# EAGLE design hdsp-clock (EAGLE 9.1.0)
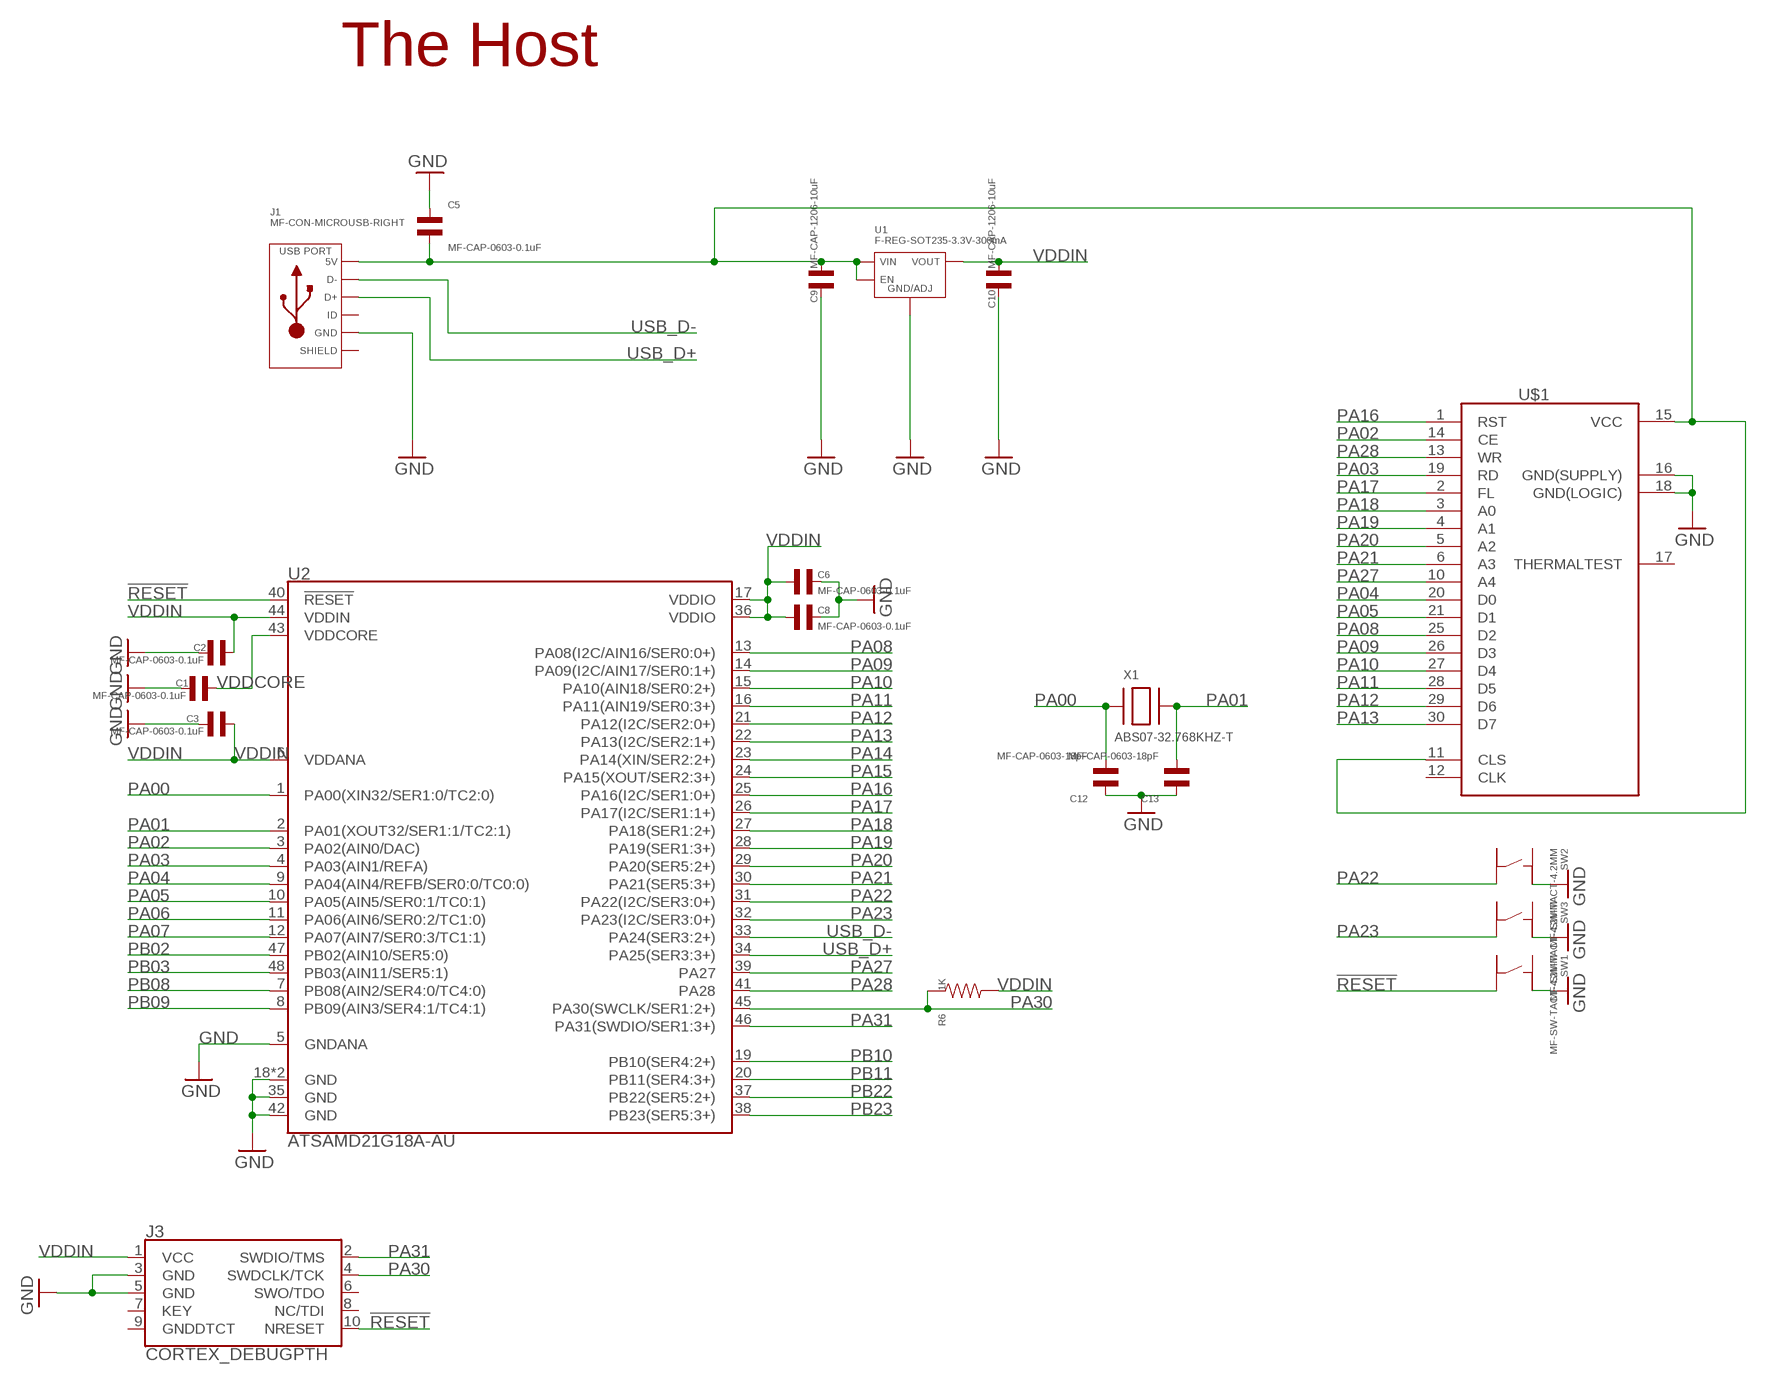
[diagram p0: schematic, sheet 1]

## Parts
C1  MF-CAP-0603-0.1uF  CAPACITOR_NP_0603  [C0603]
C2  MF-CAP-0603-0.1uF  CAPACITOR_NP_0603  [C0603]
C3  MF-CAP-0603-0.1uF  CAPACITOR_NP_0603  [C0603]
C5  MF-CAP-0603-0.1uF  CAPACITOR_NP_0603  [C0603]
C6  MF-CAP-0603-0.1uF  CAPACITOR_NP_0603  [C0603]
C8  MF-CAP-0603-0.1uF  CAPACITOR_NP_0603  [C0603]
C9  MF-CAP-1206-10uF  CAPACITOR_NP_1206  [C1206]
C10  MF-CAP-1206-10uF  CAPACITOR_NP_1206  [C1206]
C12  MF-CAP-0603-18pF  CAPACITOR_NP_0603  [C0603]
C13  MF-CAP-0603-18pF  CAPACITOR_NP_0603  [C0603]
J1  MF-CON-MICROUSB-RIGHT  USB_MICRO_RIGHT  [MICROUSB-RIGHT]
J3  CORTEX_DEBUGPTH  [2X5-PTH-1.27MM]
R6  1K  RESISTOR_0603  [R0603]
SW1  MF-SW-TACT-4.2MM  TACT_4.2MM  [TACT4.2MM]
SW2  MF-SW-TACT-4.2MM  TACT_4.2MM  [TACT4.2MM]
SW3  MF-SW-TACT-4.2MM  TACT_4.2MM  [TACT4.2MM]
U1  F-REG-SOT235-3.3V-300mA  TLV70233PDBVR  [SOT-23-5]
U2  ATSAMD21G18A-AU  ATSAMD21G-M  [QFN-48]
U$1  HDSP-253X  [HDSP-253X]
X1  ABS07-32.768KHZ-T  XTAL-3.2X1.5  [XTAL3215]

## Nets
!RESET: J3.10(NRESET) SW1.P$4 U2.40(!RESET!)
GND [Power]: C1.P$2 C2.P$1 C3.P$1 C5.P$1 C6.P$1 C8.P$1 C9.P$2 C10.P$2 C12.P$1 C13.P$1 J1.5(GND) J3.3(GND) J3.5(GND) SW1.P$2 SW2.P$2 SW3.P$2 U1.P$2(GND/ADJ) U1.P$4(GND/ADJ) U2.5(GNDANA) U2.18(GND) U2.35(GND) U2.42(GND) U2.EP(GND) U$1.16(GND(SUPPLY)) U$1.18(GND(LOGIC))
N$25: C5.P$2 C9.P$1 J1.1(5V) U1.P$1(VIN) U1.P$3(EN) U$1.11(CLS) U$1.15(VCC)
PA00: C12.P$2 U2.1(PA00(XIN32/SER1:0/TC2:0)) X1.P$1
PA01: C13.P$2 U2.2(PA01(XOUT32/SER1:1/TC2:1)) X1.P$2
PA02: U2.3(PA02(AIN0/DAC)) U$1.14(CE)
PA03: U2.4(PA03(AIN1/REFA)) U$1.19(RD)
PA04: U2.9(PA04(AIN4/REFB/SER0:0/TC0:0)) U$1.20(D0)
PA05: U2.10(PA05(AIN5/SER0:1/TC0:1)) U$1.21(D1)
PA06: U2.11(PA06(AIN6/SER0:2/TC1:0))
PA07: U2.12(PA07(AIN7/SER0:3/TC1:1))
PA08: U2.13(PA08(I2C/AIN16/SER0:0+)) U$1.25(D2)
PA09: U2.14(PA09(I2C/AIN17/SER0:1+)) U$1.26(D3)
PA10: U2.15(PA10(AIN18/SER0:2+)) U$1.27(D4)
PA11: U2.16(PA11(AIN19/SER0:3+)) U$1.28(D5)
PA12: U2.21(PA12(I2C/SER2:0+)) U$1.29(D6)
PA13: U2.22(PA13(I2C/SER2:1+)) U$1.30(D7)
PA14: U2.23(PA14(XIN/SER2:2+))
PA15: U2.24(PA15(XOUT/SER2:3+))
PA16: U2.25(PA16(I2C/SER1:0+)) U$1.1(RST)
PA17: U2.26(PA17(I2C/SER1:1+)) U$1.2(FL)
PA18: U2.27(PA18(SER1:2+)) U$1.3(A0)
PA19: U2.28(PA19(SER1:3+)) U$1.4(A1)
PA20: U2.29(PA20(SER5:2+)) U$1.5(A2)
PA21: U2.30(PA21(SER5:3+)) U$1.6(A3)
PA22: SW2.P$4 U2.31(PA22(I2C/SER3:0+))
PA23: SW3.P$4 U2.32(PA23(I2C/SER3:0+))
PA27: U2.39(PA27) U$1.10(A4)
PA28: U2.41(PA28) U$1.13(WR)
PA30: J3.4(SWDCLK/TCK) R6.P$1 U2.45(PA30(SWCLK/SER1:2+))
PA31: J3.2(SWDIO/TMS) U2.46(PA31(SWDIO/SER1:3+))
PB02: U2.47(PB02(AIN10/SER5:0))
PB03: U2.48(PB03(AIN11/SER5:1))
PB08: U2.7(PB08(AIN2/SER4:0/TC4:0))
PB09: U2.8(PB09(AIN3/SER4:1/TC4:1))
PB10: U2.19(PB10(SER4:2+))
PB11: U2.20(PB11(SER4:3+))
PB22: U2.37(PB22(SER5:2+))
PB23: U2.38(PB23(SER5:3+))
USB_D+: J1.3(D+) U2.34(PA25(SER3:3+))
USB_D-: J1.2(D-) U2.33(PA24(SER3:2+))
VDDCORE: C1.P$1 U2.43(VDDCORE)
VDDIN: C2.P$2 C3.P$2 C6.P$2 C8.P$2 C10.P$1 J3.1(VCC) R6.P$2 U1.P$5(VOUT) U2.6(VDDANA) U2.17(VDDIO) U2.36(VDDIO) U2.44(VDDIN)
Unconnected: J1.4(ID) J3.6(SWO/TDO) J3.7(KEY) J3.8(NC/TDI) J3.9(GNDDTCT) SW1.P$1 SW1.P$3 SW2.P$1 SW2.P$3 SW3.P$1 SW3.P$3 U$1.12(CLK) U$1.17(THERMALTEST)

## Notes on the sheet
- The Host

## Power pins joined to a net without a drawn wire
SLD: J1.S1(SLD) J1.S2(SLD) J1.S3(SLD) J1.S4(SLD) J1.S5(SLD) J1.S6(SLD)

## Library data of the parts
C1-C3 C5 C6 C8-C10 C12 C13 = MF_Passives:CAPACITOR_NP: Library: MF_Passives Description: Device for Non-Polarized Capacitors. Manufacture part number (MPN) can be added via Attributes. Check https://factory.macrofab.com/parts for the house parts list.; POPULATE: 1
J1 = MF_Connectors:USB: Library: MF_Connectors Description: 5 Pin USB Connectors. SLD is the shield connection. Usually tied to ground through a small ferrite bead.; HOUSEPART: YES; MPN: MF-CON-MICROUSB-RIGHT; POPULATE: 1; URL: https://factory.macrofab.com/part/MF-CON-MICROUSB-RIGHT
J3 = SparkFun-Connectors:CORTEX_DEBUG: Cortex Debug Connector Datasheet <http://infocenter.arm.com/help/topic/com.arm.doc.faqs/attached/13634/cortex_debug_connectors.pdf>
R6 = MF_Passives:RESISTOR: Library: MF_Passives Description: Device for Resistors. Manufacture part number (MPN), Voltage, Tolerance, and Wattage Rating can be added via Attributes. Check https://factory.macrofab.com/parts for the house parts list.; POPULATE: 1
SW1-SW3 = MF_Switches:TACT: Library: MF_Switches Description: Device for Tact Switches. Manufacture part number (MFG#) can be added via Attributes.; HOUSEPART: YES; MPN: MF-SW-TACT-4.2MM; POPULATE: 1; URL: https://factory.macrofab.com/part/MF-SW-TACT-4.2MM
U1 = MF_IC_Power:TLV702: Manufacturer Part #: TLV702 Manufacturer: Texas Instruments Description: LDO Voltage Regulators; HOUSEPART: YES; MPN: F-REG-SOT235-3.3V-300mA; POPULATE: 1; URL: https://factory.macrofab.com/part/MF-REG-SOT235-3.3V-300mA
U2 = SparkFun-DigitalIC:ATSAMD21G: Atmel SAMD21G SMART ARM-Based Microcontroller The Atmel ® | SMART ™ SAM D21 is a series of low-power microcontrollers using the 32-bit ARM ® Cortex ® -M0+ processor, and ranging from 32- to 64-pins with up to 256KB Flash and 32KB of SRAM. The SAM D21 devices operate at a maximum frequency of 48MHz and reach 2.46 CoreMark/MHz. They are designed for simple and intuitive migration with identical peripheral modules, hex compatible code, identical linear address map and pin compatible migration paths between all devices in the product series. All devices include intelligent and flexible peripherals, Atmel Event System for inter-peripheral signaling, and support for capacitive touch button, slider and wheel user interfaces.; PROD_ID: IC-13064
U$1 = sonik:HDSP-253X
X1 = adafruit:XTAL: Low cost SMT crystals, no capacitors included http://www.ladyada.net/library/eagle

## Net classes
1 Power: width 0.203 mm

## Board
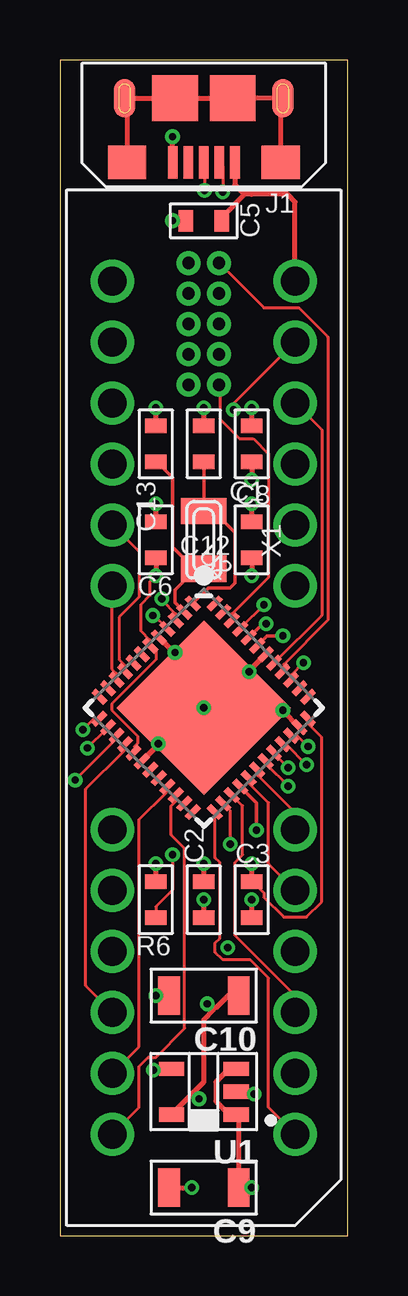
[diagram p1: board, top side]
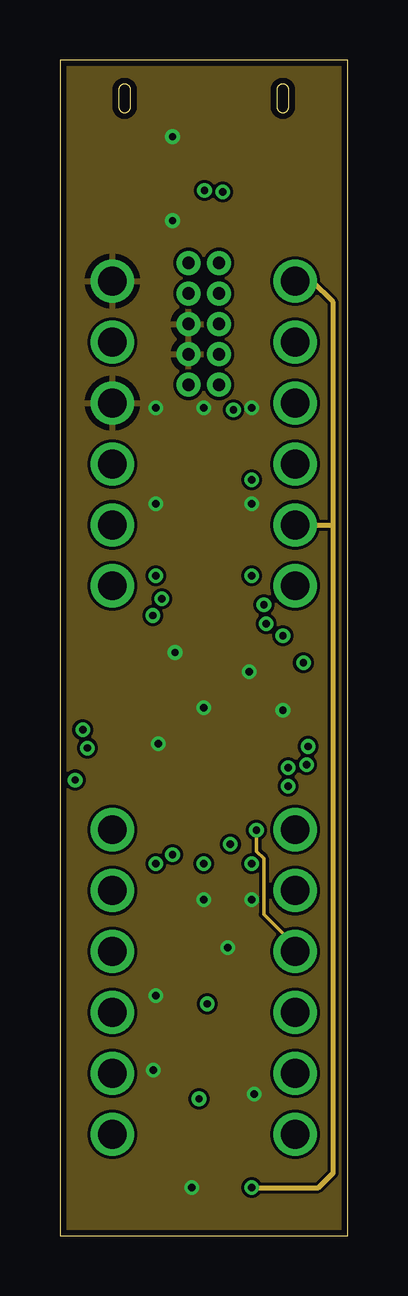
[diagram p2: board, inner layer Route2]
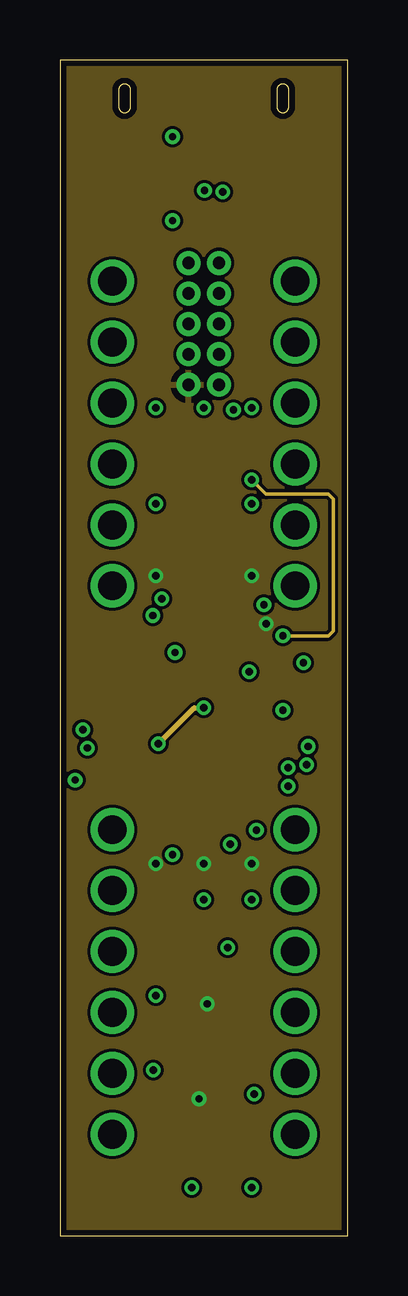
[diagram p3: board, inner layer Route15]
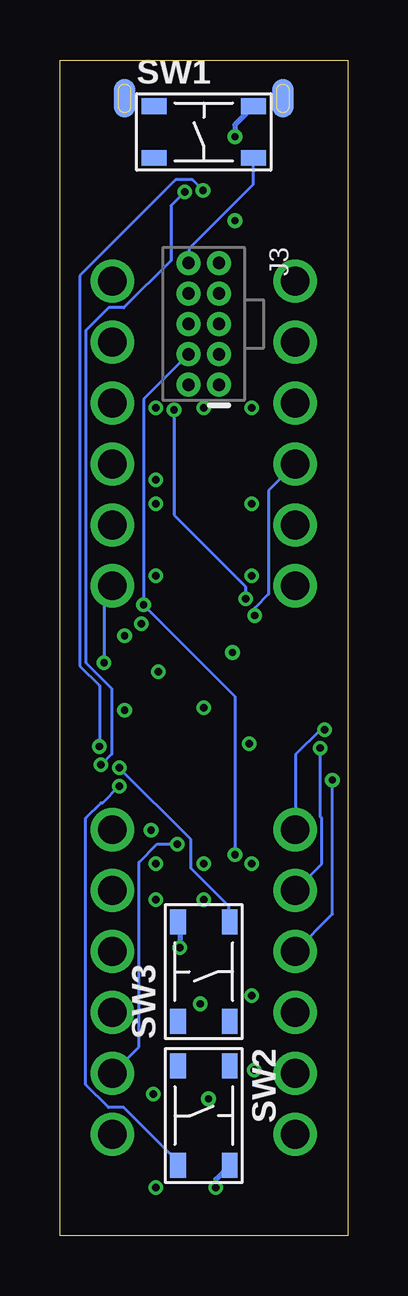
[diagram p4: board, bottom side, seen from below]

Size 12 x 49 mm. Coordinates in mm from the lower left corner, seen from the top.
Outline: 0,0 12,0 12,49 0,49 0,0
Copper layers (1*2*15*16): Top 0.035mm / dielectric 0.23mm / Route2 0.035mm / dielectric 0.93mm / Route15 0.035mm / dielectric 0.23mm / Bottom 0.035mm
Design rules "MF_Standard_4_Layer": minimum track width 5mil, minimum drill 12mil, track to track 5mil, track to pad 5mil, pad to pad 5mil, via to via 5mil, smd to smd 0mil, copper to edge 10mil, drill to drill 10mil, minimum pad ring 6mil, minimum via ring 6mil, stop-mask expansion 2mil, vias tented up to drill 25mil, thermal gap 10mil

### Footprints (pad centres in the part's own frame; a part is rotated, then mirrored left to right if it is on the bottom)
C0603 = smd 0.6 x 0.9: P$1 -0.75,0; P$2 0.75,0
C1206 = smd 0.9 x 1.6: P$1 -1.45,0; P$2 1.45,0
MICROUSB-RIGHT = smd 0.4 x 1.35: 1 -1.3,1.27; 2 -0.65,1.27; 3 0,1.27; 4 0.65,1.27; 5 1.3,1.27 | smd 0.9 x 1.6: S1 -3.3,-1.4; S2 3.3,-1.4 | smd 1.6 x 1.4: S3 -3.2,1.27; S4 3.2,1.27 | smd 1.9 x 1.9: S5 -1.2,-1.405; S6 1.2,-1.405 | smd 0.9 x 1.6 bottom: S7 -3.3,-1.4; S8 3.3,-1.4
2X5-PTH-1.27MM = drill 0.508 pad 1: 1 -2.54,-0.635; 2 -2.54,0.635; 3 -1.27,-0.635; 4 -1.27,0.635; 5 0,-0.635; 6 0,0.635; 7 1.27,-0.635; 8 1.27,0.635; 9 2.54,-0.635; 10 2.54,0.635
R0603 = smd 0.6 x 0.9: P$1 -0.75,0; P$2 0.75,0
TACT4.2MM = smd 1.05 x 0.65: P$1 -2.075,1.075; P$2 2.075,1.075; P$3 -2.075,-1.075; P$4 2.075,-1.075
SOT-23-5 = smd 1.05 x 0.6: P$1 -1.35,0.95; P$2 -1.35,0; P$3 -1.35,-0.95; P$4 1.35,-0.95; P$5 1.35,0.95
QFN-48 = smd 0.7 x 0.25: 1 -3.4,2.75; 2 -3.4,2.25; 3 -3.4,1.75; 4 -3.4,1.25; 5 -3.4,0.75; 6 -3.4,0.25; 7 -3.4,-0.25; 8 -3.4,-0.75; 9 -3.4,-1.25; 10 -3.4,-1.75; 11 -3.4,-2.25; 12 -3.4,-2.75; 25 3.4,-2.75; 26 3.4,-2.25; 27 3.4,-1.75; 28 3.4,-1.25; 29 3.4,-0.75; 30 3.4,-0.25; 31 3.4,0.25; 32 3.4,0.75; 33 3.4,1.25; 34 3.4,1.75; 35 3.4,2.25; 36 3.4,2.75 | smd 0.25 x 0.7: 13 -2.75,-3.4; 14 -2.25,-3.4; 15 -1.75,-3.4; 16 -1.25,-3.4; 17 -0.75,-3.4; 18 -0.25,-3.4; 19 0.25,-3.4; 20 0.75,-3.4; 21 1.25,-3.4; 22 1.75,-3.4; 23 2.25,-3.4; 24 2.75,-3.4; 37 2.75,3.4; 38 2.25,3.4; 39 1.75,3.4; 40 1.25,3.4; 41 0.75,3.4; 42 0.25,3.4; 43 -0.25,3.4; 44 -0.75,3.4; 45 -1.25,3.4; 46 -1.75,3.4; 47 -2.25,3.4; 48 -2.75,3.4 | smd 5.15 x 5.15: EP 0,0
HDSP-253X = drill 1.2: 1 -17.78,-3.81; 2 -15.24,-3.81; 3 -12.7,-3.81; 4 -10.16,-3.81; 5 -7.62,-3.81; 6 -5.08,-3.81; 10 5.08,-3.81; 11 7.62,-3.81; 12 10.16,-3.81; 13 12.7,-3.81; 14 15.24,-3.81; 15 17.78,-3.81; 16 17.78,3.81; 17 15.24,3.81; 18 12.7,3.81; 19 10.16,3.81; 20 7.62,3.81; 21 5.08,3.81; 25 -5.08,3.81; 26 -7.62,3.81; 27 -10.16,3.81; 28 -12.7,3.81; 29 -15.24,3.81; 30 -17.78,3.81
XTAL3215 = smd 1.1 x 1.9: P$1 1.2,0; P$2 -1.2,0

### Placement (x,y rotation side)
C1  8,33 90 top
C2  6,14 90 top
C3  8,14 90 top
C5  6,42.3 0 top
C6  4,29 270 top
C8  8,29 270 top
C9  6,2 180 top
C10  6,10 180 top
C12  6,33 270 top
C13  4,33 270 top
J1  6,46 180 top
J3  6,38 90 bottom
R6  4,14 90 top
SW1  6,46 0 bottom
SW2  6,5 270 bottom
SW3  6,11 90 bottom
U1  6,6 180 top
U2  6,22 315 top
U$1  6,22 90 top
X1  6,29 90 top

### Tracks (layer width: path | path; a pad name or v marks a point on that pad's centre or on a via)
!RESET
  Top 0.127: U2.40 9.34,23.56 9.34,23.81 11.18,25.65 11.18,37.47 9.97,38.67 8.51,38.67 6.67,40.51 J3.10
  Bottom 0.127: SW1.P$4 3.94,44.9 3.94,43.81 6.6,41.15 6.6,40.58 J3.10
GND  (via drill 0.3)
  Top 0.203: C3.P$1 v8,14 | C2.P$1 v6,14 | C10.P$2 v4,10 | U1.P$2 7.7,6 7.8,5.9 v8.1,5.9 | U1.P$4 3.95,6.95 v3.9,6.9 | C9.P$2 v5.5,2 | C5.P$1 v4.7,42.3 | J1.5 v4.7,45.8 | C13.P$1 v4,34.5 | C12.P$1 v6,34.5 | C1.P$2 v8,34.5 | U2.42 7.9,23.55 v7.9,23.5 | U2.5 4.76,24.3 v4.8,24.3 | U2.18 4.1,20.45 v4.1,20.5 | U2.35 9.3,21.88 v9.3,21.9 | C6.P$1 v4,30.5 | C8.P$1 v8,30.5
  Route15 0.203: v4.1,20.5 5.6,22 U2.EP
  Bottom 0.203: SW3.P$2 7,13 v7,12 | SW2.P$2 5.5,2.35 v5.5,2 | SW1.P$2 4.7,46.3 v4.7,45.8
  other vias: 6,22
  pour Route2: 0,48.96 12,48.96 12,0 0,0
N$25  (via drill 0.3)
  Top 0.203: v8,2 C9.P$1 7.45,4.95 U1.P$1 7.05,5.05 6.5,5.6 6.5,6.4 7.05,6.95 U1.P$3 | U$1.15 9.81,43.09 9.5,43.4 8,43.4 7.7,43.4 | 7.7,43.4 6.75,42.45 C5.P$2 | J1.1 7.3,43.8 7.7,43.4
  Route2 0.203: 11.4,29.6 11.4,2.61 10.78,1.99 v8.01,1.99 v8,2 | 11.4,29.6 11.4,38.9 10.52,39.78 U$1.15 | U$1.11 11.38,29.62 11.4,29.6
PA00
  Top 0.152: C12.P$2 X1.P$1 6.4,30.2 7.3,29.3 7.3,27.2 7.1,27 6.19,27 U2.1
PA01
  Top 0.152: C13.P$2 4.05,32.25 4.7,31.6 4.7,28.7 5.6,27.8 X1.P$2 5.7,27.8 4.8,26.9 4.8,26.38 U2.2
PA02  (via drill 0.3)
  Top 0.127: v4.25,26.54 4.25,26.48 4.83,25.91 4.83,25.65 U2.3 | v7.24,34.42 7.24,34.67 9.78,37.21 U$1.14
  Bottom 0.127: v4.25,26.54 4.25,27.05 7.24,30.04 v7.24,34.42
PA03  (via drill 0.3)
  Top 0.127: v3.87,25.84 3.94,25.84 4.45,25.34 U2.4
  Bottom 0.127: v3.87,25.84 3.87,26.16 3.3,26.73 3.3,31.05 2.22,32.13 U$1.19
PA04
  Top 0.127: U2.9 2.67,23.56 2.67,23.81 2.48,24 2.48,25.78 3.3,26.61 3.3,28.51 2.22,29.59 U$1.20
PA05
  Top 0.127: U2.10 2.35,23.18 2.35,23.43 2.16,23.62 2.16,27.05 U$1.21
PA08  (via drill 0.3)
  Top 0.127: v0.95,21.08 1.4,21.53 1.65,21.53 U2.13
  Bottom 0.127: v0.95,21.08 1.14,21.08 2.16,20.07 2.16,16.95 U$1.25
PA09  (via drill 0.3)
  Top 0.127: v1.14,20.32 1.97,21.14 U2.14
  Bottom 0.127: v1.14,20.32 1.14,17.46 1.08,17.4 1.08,15.49 2.16,14.41 U$1.26
PA10  (via drill 0.3)
  Top 0.127: v0.64,18.99 2.35,20.7 2.35,20.83 U2.15
  Bottom 0.127: v0.64,18.99 0.64,13.4 2.16,11.87 U$1.27
PA11
  Top 0.127: U2.16 2.67,20.45 2.67,20.19 1.08,18.61 1.08,10.41 2.16,9.34 U$1.28
PA12
  Top 0.127: U2.21 4.45,18.67 4.45,18.48 3.3,17.34 3.3,7.87 2.22,6.79 U$1.29
PA13
  Top 0.127: U2.22 4.83,18.1 4.64,17.91 4.64,16.7 5.21,16.13 5.21,8.64 4,7.43 3.68,7.43 3.3,7.05 3.3,5.33 2.22,4.25 U$1.30
PA16
  Top 0.127: U2.25 6.48,17.59 6.48,15.75 6.67,15.56 6.67,12.38 6.48,12.19 6.48,11.81 6.79,11.49 7.94,11.49 8.7,10.73 8.7,5.33 9.78,4.25 U$1.1
PA17  (via drill 0.3)
  Top 0.127: v7.11,16.32 7.11,17.7 U2.26
  Bottom 0.127: v7.11,16.32 7.94,16.32 8.7,15.56 8.7,7.87 9.78,6.79 U$1.2
PA18
  Top 0.127: U2.27 7.62,17.91 7.62,15.87 7.3,15.56 7.3,12.51 9.78,10.03 9.78,9.34 U$1.3
PA19  (via drill 0.3)
  Top 0.152: U2.28 8.2,18.03 v8.2,16.9
  Route2 0.152: v8.2,16.9 8.2,16.02 8.51,15.71 8.51,13.39 9.81,12.09 U$1.4
PA20
  Top 0.127: U2.29 7.87,19.05 7.87,18.86 8.7,18.03 8.7,15.49 9.78,14.41 U$1.5
PA21
  Top 0.127: U2.30 8.26,19.37 8.26,19.18 9.78,17.65 9.78,16.95 U$1.6
PA22  (via drill 0.3)
  Top 0.127: v9.53,18.73 8.64,19.62 8.64,19.75 U2.31
  Bottom 0.127: v9.53,18.73 10.22,18.03 10.29,18.03 10.92,17.4 10.92,6.29 9.97,5.33 9.34,5.33 7.11,3.11 7.11,2.98 SW2.P$4
PA23  (via drill 0.3)
  Top 0.127: v9.53,19.49 8.95,20.07 U2.32
  Bottom 0.127: v9.53,19.49 6.54,16.51 6.54,15.3 4.95,13.72 4.95,13.08 SW3.P$4
PA27  (via drill 0.3)
  Top 0.127: v10.16,23.88 9.65,23.37 9.65,23.18 U2.39
  Bottom 0.127: v10.16,23.88 10.16,26.73 9.84,27.05 U$1.10
PA28
  Top 0.127: U2.41 8.95,23.88 10.92,25.84 10.92,33.59 9.84,34.67 U$1.13
PA30  (via drill 0.3)
  Top 0.127: v8.51,26.29 7.56,25.34 U2.45 | v4.7,15.88 4.7,14.41 4,13.72 4,13.27 R6.P$1
  Bottom 0.127: J3.4 6.67,36.7 8.51,34.86 v8.51,26.29 4.7,22.48 v4.7,15.88
PA31
  Top 0.127: U2.46 7.18,25.65 7.18,25.91 8.7,27.43 8.7,32.58 8.06,33.21 7.49,33.21 6.67,34.04 6.67,35.43 J3.2
SLD
  Top 0.203: J1.S4 2.8,47.3 J1.S2 J1.S6 7,47.41 | J1.S3 9.2,47.3 J1.S1 7,47.41 | 7,47.41 J1.S5
USB_D+  (via drill 0.3)
  Top 0.127: v10.35,20.38 9.91,20.83 9.65,20.83 U2.34 | v6.03,43.56 6.03,44.7 J1.3
  Bottom 0.127: v10.35,20.38 10.35,22.92 11.18,23.75 11.18,40.01 7.18,44.01 6.48,44.01 v6.03,43.56
USB_D-  (via drill 0.3)
  Top 0.127: v10.29,19.62 9.46,20.45 9.34,20.45 U2.33 | v6.79,43.5 6.79,44.58 6.67,44.7 J1.2
  Bottom 0.127: v10.29,19.62 9.84,20.07 9.84,22.8 10.92,23.88 10.92,37.72 9.97,38.67 9.34,38.67 7.37,40.64 7.37,42.93 v6.79,43.5
VDDCORE  (via drill 0.3)
  Top 0.152: U2.43 8.64,24.99 8.81,24.99 8.82,25 v9.3,25
  Top 0.203: C1.P$1 v8,31.5
  Route15 0.152: v9.3,25 11.2,25 11.4,25.2 11.4,30.7 11.2,30.9 8.6,30.9 v8,31.5
VDDIN  (via drill 0.3)
  Top 0.127: U2.17 3.11,20.13 3.11,20.38 3.24,20.51 3.24,20.83 2.16,21.91 2.16,22.16 4,24 4,24.38 3.81,24.57 U2.6 3.75,24.64 3.75,24.83 3.37,25.21 3.37,26.29 3.75,26.67 3.75,27.24 3.94,27.43 v4,27.5 | U2.36 10.35,21.53 10.35,21.34 10.92,20.77 10.92,13.91 10.29,13.27 9.34,13.27 8.51,14.1 8.51,14.29 8.06,14.73 C3.P$2 | 6.5,9.5 6.41,9.53 v6.14,9.65
  Top 0.152: U2.44 8.44,25.5 v8.6,25.5
  Top 0.203: R6.P$2 v4,15.5 | C2.P$2 v6,15.5 | C3.P$2 v8,15.5 | 5.5,5.9 5.8,6.2 | 5.8,6.2 6,6.4 6,9 | 6,9 6.4,9.4 v6.14,9.65 | 6.5,9.5 7,10 C10.P$1 | 6,9 | 5.8,6.2 | 5.5,5.9 5.58,5.92 v5.8,5.7 | U1.P$5 5.5,5.9 | C6.P$2 v4,27.5 | C8.P$2 v8,27.5
  pour Route15: 0,48.96 12,48.96 12,0 0,0